# Altium schematic sheet L293DbaseArduVehicle-ElectricalSchematic_2022-03-31.schdoc
size 267 x 180 mm
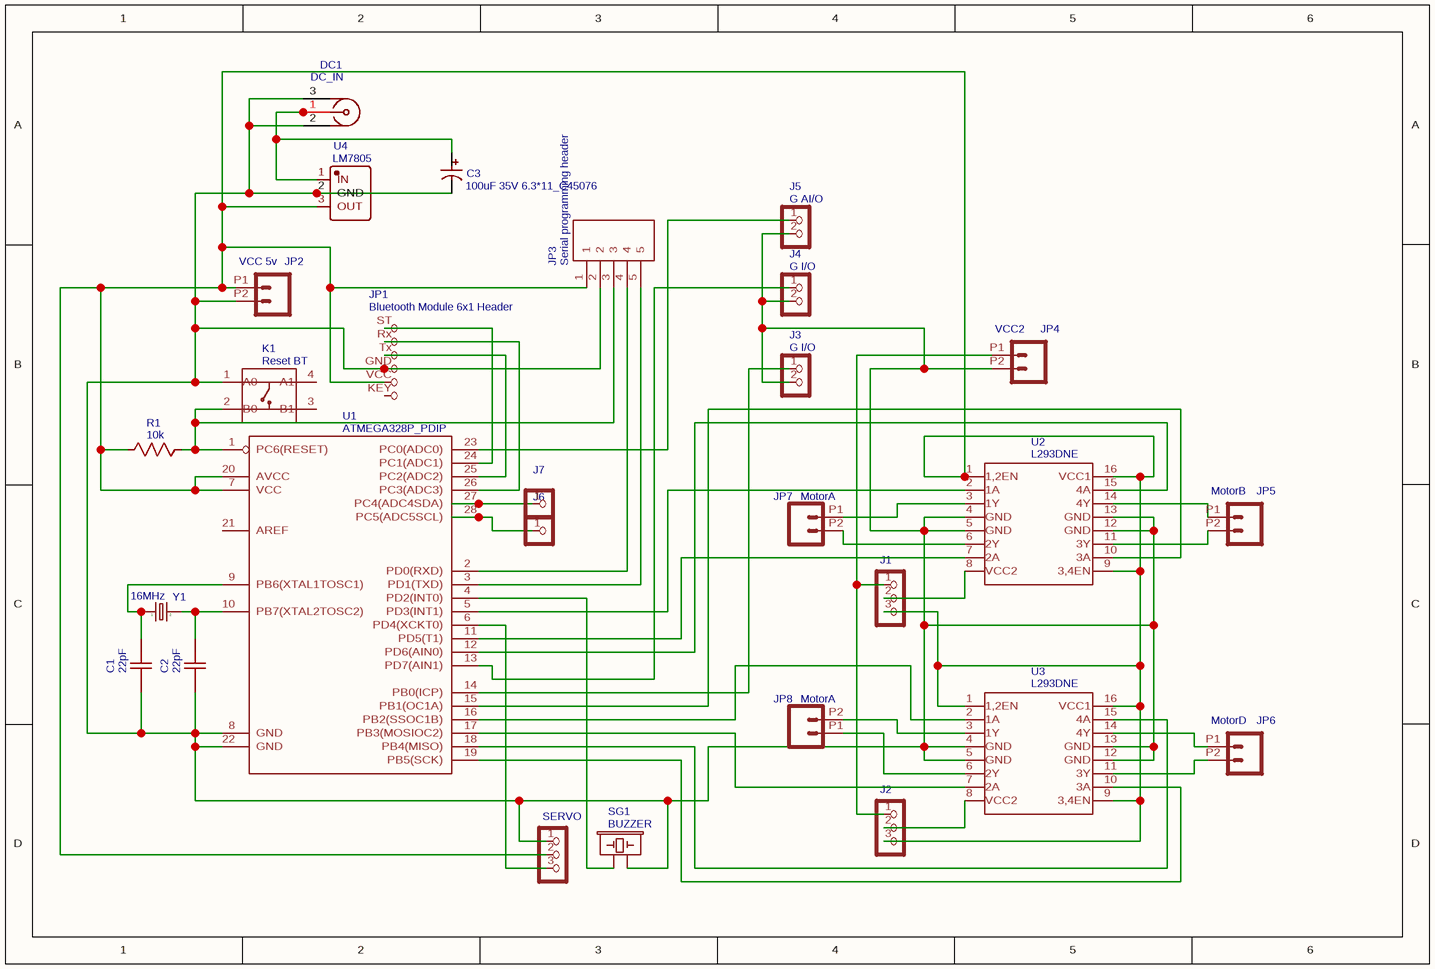
[diagram p0: L293DbaseArduVehicle-ElectricalSchematic_2022-03-31.schdoc]

## Parts
C1  22pF  [RAD-0.1]
C2  22pF  [RAD-0.1]
C3  100uF 35V 6.3*11_C45076  [CAP-TH_BD6.3-P2.50-D0.5-FD]
DC1  DC_IN  [DC-5020]
J1  CON_HEADER_1X03-PTH  [M1X3]  (value not drawn)
J2  CON_HEADER_1X03-PTH  [M1X3]  (value not drawn)
J3  G I/O  [M1X2]
J4  G I/O  [M1X2]
J5  G AI/O  [M1X2]
J6  CON_HEADER_1X01-PTH  [M1X1]  (value not drawn)
J7  CON_HEADER_1X01-PTH  [M1X1]  (value not drawn)
JP1  Bluetooth Module 6x1 Header  [BLUETOOTH MODULE 6X1 HEADER]
JP2  VCC 5v  [1X02_2.54_SCREWTERM]
JP3  Serial programming header  [B5B-PH-K-S]
JP4  VCC2  [1X02_2.54_SCREWTERM]
JP5  MotorB  [1X02_2.54_SCREWTERM]
JP6  MotorD  [1X02_2.54_SCREWTERM]
JP7  MotorA  [1X02_2.54_SCREWTERM]
JP8  MotorA  [1X02_2.54_SCREWTERM]
K1  Reset BT  [SW4-6.0X6.0X5.0MM]
R1  10k  [AXIAL-0.3]
SERVO  CON_HEADER_1X03-PTH  [M1X3]  (value not drawn)
SG1  BUZZER  [BUZZER-12MM]
U1  ATMEGA328P_PDIP  [DIP28-300]
U2  L293DNE  [DIP16-2.54-19.2X7.62MM]
U3  L293DNE  [DIP16-2.54-19.2X7.62MM]
U4  LM7805  [TO-220-3_L10.0-W4.5-P2.54-L]
Y1  16MHz  [HC49US]

## Nets
NetC1_1: C1.1 C2.1 C3.2 DC1.2 DC1.3(GND) J3.2 J4.2 J5.2 JP1.GND JP2.P2 JP3.2 JP4.P2 K1.1(A0) SERVO.1 SG1.- U1.8(GND) U1.22(GND) U2.4(GND) U2.5(GND) U2.12(GND) U2.13(GND) U3.4(GND) U3.5(GND) U3.12(GND) U3.13(GND) U4.2(GND)
NetC1_2: C1.2 U1.9(PB6(XTAL1TOSC1)) Y1.1
NetC2_2: C2.2 U1.10(PB7(XTAL2TOSC2)) Y1.2
NetC3_1: C3.1 DC1.1(VCC) U4.1(IN)
NetJ1_1: J1.1 J2.1 JP4.P1
NetJ1_2: J1.2 U2.8(VCC2)
NetJ1_3: J1.3 J2.3 JP1.VCC JP2.P1 JP3.1 R1.1 SERVO.2 U1.7(VCC) U1.20(AVCC) U2.1(1,2EN) U2.9(3,4EN) U2.16(VCC1) U3.1(1,2EN) U3.9(3,4EN) U3.16(VCC1) U4.3(OUT)
NetJ2_2: J2.2 U3.8(VCC2)
NetJ3_1: J3.1 U1.14(PB0(ICP))
NetJ4_1: J4.1 U1.13(PD7(AIN1))
NetJ5_1: J5.1 U1.23(PC0(ADC0))
NetJ6_1: J6.1 U1.28(PC5(ADC5SCL))
NetJ7_1: J7.1 U1.27(PC4(ADC4SDA))
NetJP1_Rx: JP1.Rx U1.26(PC3(ADC3))
NetJP1_ST: JP1.ST U1.24(PC1(ADC1))
NetJP1_Tx: JP1.Tx U1.25(PC2(ADC2))
NetJP3_3: JP3.3 K1.2(B0) R1.2 U1.1(PC6(RESET))
NetJP3_4: JP3.4 U1.2(PD0(RXD))
NetJP3_5: JP3.5 U1.3(PD1(TXD))
NetJP5_P1: JP5.P1 U2.14(4Y)
NetJP5_P2: JP5.P2 U2.11(3Y)
NetJP6_P1: JP6.P1 U3.14(4Y)
NetJP6_P2: JP6.P2 U3.11(3Y)
NetJP7_P1: JP7.P1 U2.3(1Y)
NetJP7_P2: JP7.P2 U2.6(2Y)
NetJP8_P1: JP8.P1 U3.6(2Y)
NetJP8_P2: JP8.P2 U3.3(1Y)
NetSERVO_3: SERVO.3 U1.6(PD4(XCKT0))
NetSG1_+: SG1.+ U1.4(PD2(INT0))
NetU1_5: U1.5(PD3(INT1)) U2.2(1A)
NetU1_11: U1.11(PD5(T1)) U2.7(2A)
NetU1_12: U1.12(PD6(AIN0)) U2.15(4A)
NetU1_15: U1.15(PB1(OC1A)) U2.10(3A)
NetU1_16: U1.16(PB2(SSOC1B)) U3.2(1A)
NetU1_17: U1.17(PB3(MOSIOC2)) U3.7(2A)
NetU1_18: U1.18(PB4(MISO)) U3.15(4A)
NetU1_19: U1.19(PB5(SCK)) U3.10(3A)

Not connected (* = marked no-connect by the designer): JP1 KEY; K1 3(B1) 4(A1); U1 21(AREF)

## Library data of the parts
C1 C2 = 22pF: nameAlias: Value(F); BOM_Manufacturer Part: ?; spicePre: C; spiceSymbolName: Capacitor
C3 = 100uF 35V 6.3*11_C45076: BOM_Manufacturer: ValuePro; Value: 100uF; BOM_Supplier Part: C45076; BOM_Supplier: LCSC; BOM_Manufacturer Part: 100uF 35V 6.3*11; BOM_JLCPCB Part Class: Extended Part; spicePre: C; spiceSymbolName: 100uF 35V 6.3*11_C45076
DC1 = DC_IN: BOM_Manufacturer Part: DC005-2.0MM; Contributor: KKHOME生活; spicePre: D; spiceSymbolName: DC_IN
J1 J2 SERVO = CON_HEADER_1X03-PTH: catid: 20; Contributor: DangerousPrototype; BOM_Manufacturer Part: ?; spicePre: J
J3 J4 = G I/O: catid: 20; Contributor: DangerousPrototype; BOM_Manufacturer Part: ?; spicePre: J
J5 = G AI/O: catid: 20; Contributor: DangerousPrototype; BOM_Manufacturer Part: ?; spicePre: J
J6 J7 = CON_HEADER_1X01-PTH: catid: 20; Contributor: DangerousPrototype; BOM_Manufacturer Part: ?; spicePre: J
JP1 = Bluetooth Module 6x1 Header: catid: 20; description: PIN HEADER; Contributor: Adafruit; sourceId: i5d7pHZhZ; timeStamp: 1458306153; BOM_Manufacturer Part: ?; spicePre: J
JP2 = VCC 5v: catid: 20; description: Standard 2-pin 0.1 header. Use with; Contributor: SparkFun; BOM_Manufacturer Part: ?; spicePre: J
JP3 = Serial programming header: catid: 20; BOM_Manufacturer Part: ?; spicePre: J
JP4 = VCC2: catid: 20; description: Standard 2-pin 0.1 header. Use with; Contributor: SparkFun; BOM_Manufacturer Part: ?; spicePre: J
JP5 = MotorB: catid: 20; description: Standard 2-pin 0.1 header. Use with; Contributor: SparkFun; BOM_Manufacturer Part: ?; spicePre: J
JP6 = MotorD: catid: 20; description: Standard 2-pin 0.1 header. Use with; Contributor: SparkFun; BOM_Manufacturer Part: ?; spicePre: J
JP7 JP8 = MotorA: catid: 20; description: Standard 2-pin 0.1 header. Use with; Contributor: SparkFun; BOM_Manufacturer Part: ?; spicePre: J
K1 = Reset BT: BOM_Manufacturer Part: TS-1109; catid: 20; description: SWITCH TACTILE SPST-NO 0.05A 12V; BOM_Supplier: SeeedStudio; spicePre: K; BOM_Supplier Part: 311020024
R1 = 10k: nameAlias: Value(Ω); BOM_Manufacturer Part: ?; spicePre: R; spiceSymbolName: Resistor
SG1 = BUZZER: catid: 20; Contributor: SparkFun; BOM_Manufacturer Part: ?; spicePre: S
U1 = ATMEGA328P_PDIP: catid: 20; description: uC used in the Arduino; Contributor: SparkFun; BOM_Manufacturer Part: ?; spicePre: U
U2 U3 = L293DNE: catid: 20; description: DIP IC Driver;; sourceId: qoicuM4mD; timeStamp: 1448011802; BOM_Supplier: SeeedStudio; BOM_Manufacturer Part: L293DNE; spicePre: U; BOM_Supplier Part: 310040017
U4 = LM7805: BOM_Manufacturer: TF; Contributor: LCSC; BOM_Supplier: LCSC; BOM_Supplier Part: C845394; BOM_Manufacturer Part: LM7805; BOM_JLCPCB Part Class: Extended Part; spicePre: U; spiceSymbolName: LM7805
Y1 = 16MHz: BOM_Manufacturer Part: HC-49US    16.000MHz; catid: 20; description: DIP Crystal 16MHz-18pF-30ppm-40R;; BOM_Supplier: SeeedStudio; spicePre: Y; BOM_Supplier Part: 306010014